# Altium schematic sheet Main.SchDoc: Oled Buttons
size A4; Author: Dániel Sinkó; Revision: A; SheetNumber: 1; SheetTotal: 1
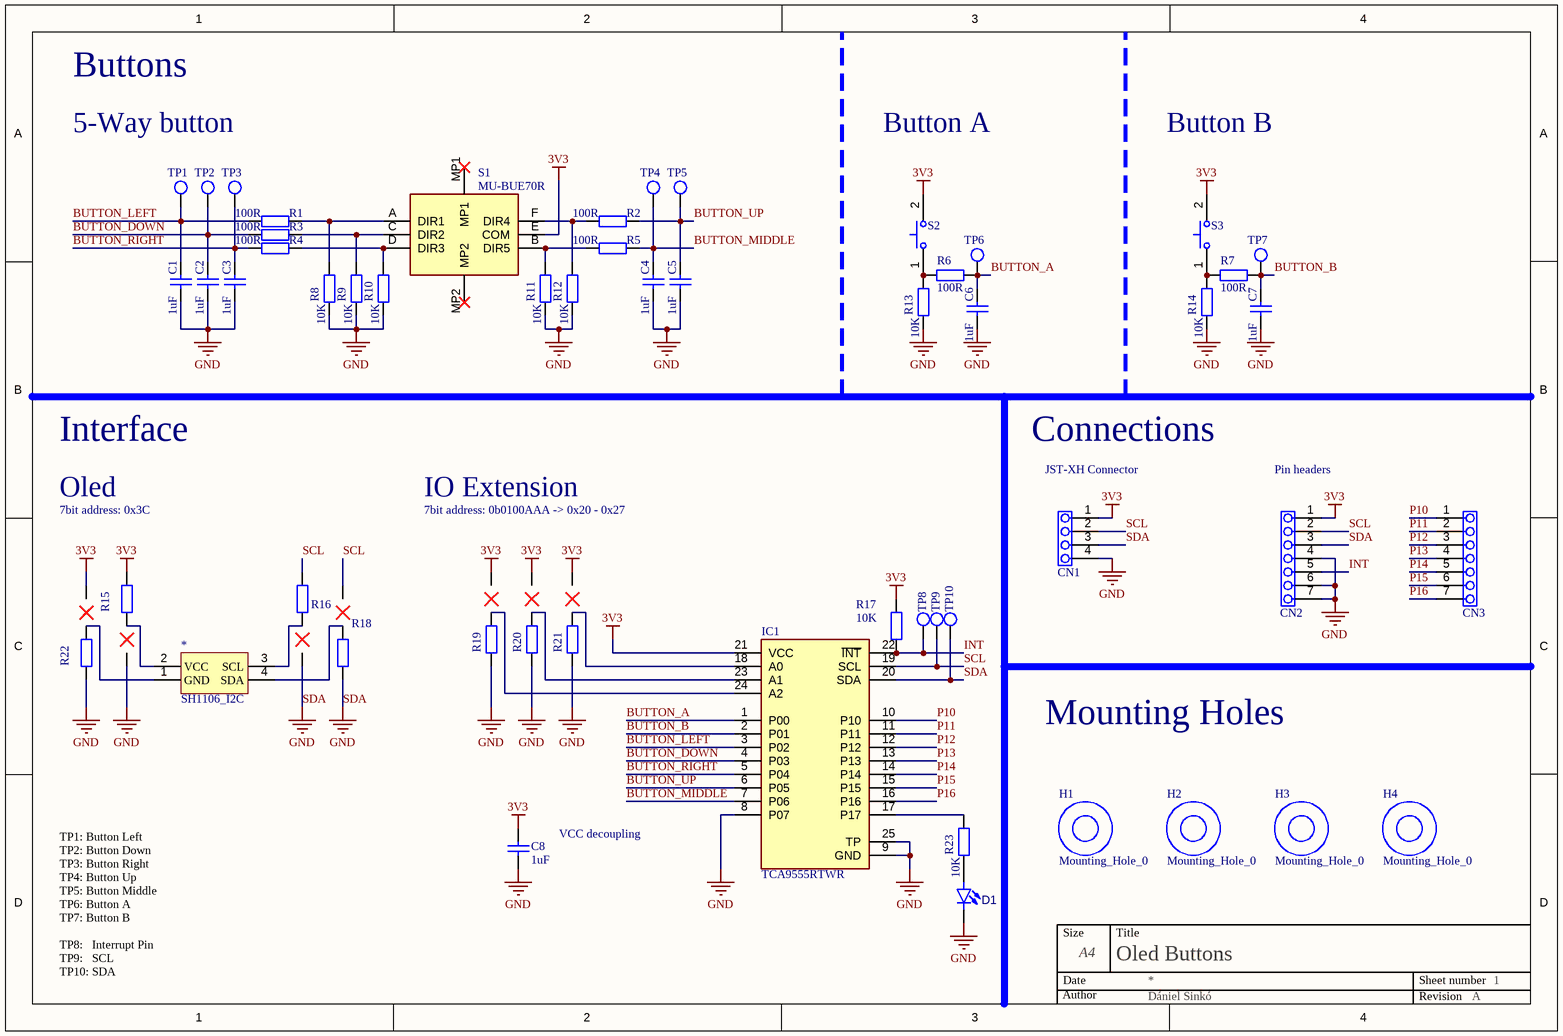
[diagram p0: Main.SchDoc]

## Parts
*  SH1106_I2C  [SH1106_I2C]
C1  1uF  [CAP0603]
C2  1uF  [CAP0603]
C3  1uF  [CAP0603]
C4  1uF  [CAP0603]
C5  1uF  [CAP0603]
C6  1uF  [CAP0603]
C7  1uF  [CAP0603]
C8  1uF  [CAP0603]
CN1  Pins 1x3  [PIN-1X4]  (value not drawn)
CN2  Pins 1x3  [PIN-1X7]  (value not drawn)
CN3  Pins 1x3  [PIN-1X7]  (value not drawn)
D1  (no value)  [LED0603]
H1  Mounting_Hole_0  [MOUNTING_HOLE_M3_0]
H2  Mounting_Hole_0  [MOUNTING_HOLE_M3_0]
H3  Mounting_Hole_0  [MOUNTING_HOLE_M3_0]
H4  Mounting_Hole_0  [MOUNTING_HOLE_M3_0]
IC1  TCA9555RTWR  [WQFN-24]
R1  100R  [RES0603]
R2  100R  [RES0603]
R3  100R  [RES0603]
R4  100R  [RES0603]
R5  100R  [RES0603]
R6  100R  [RES0603]
R7  100R  [RES0603]
R8  10K  [RES0603]
R9  10K  [RES0603]
R10  10K  [RES0603]
R11  10K  [RES0603]
R12  10K  [RES0603]
R13  10K  [RES0603]
R14  10K  [RES0603]
R15  *  [RES0603 _SELECTION]  (value not drawn)
R16  *  [RES0603 _SELECTION]  (value not drawn)
R17  10K  [RES0603]
R18  *  [RES0603 _SELECTION]  (value not drawn)
R19  *  [RES0603 _SELECTION]  (value not drawn)
R20  *  [RES0603 _SELECTION]  (value not drawn)
R21  *  [RES0603 _SELECTION]  (value not drawn)
R22  *  [RES0603 _SELECTION]  (value not drawn)
R23  10K  [RES0603]
S1  MU-BUE70R  [MUBUE70R]
S2  SKPMANE010  [SKPMAPE010]  (value not drawn)
S3  SKPMANE010  [SKPMAPE010]  (value not drawn)
TP1  Test Point  [TP_PAD]  (value not drawn)
TP2  Test Point  [TP_PAD]  (value not drawn)
TP3  Test Point  [TP_PAD]  (value not drawn)
TP4  Test Point  [TP_PAD]  (value not drawn)
TP5  Test Point  [TP_PAD]  (value not drawn)
TP6  Test Point  [TP_PAD]  (value not drawn)
TP7  Test Point  [TP_PAD]  (value not drawn)
TP8  Test Point  [TP_PAD]  (value not drawn)
TP9  Test Point  [TP_PAD]  (value not drawn)
TP10  Test Point  [TP_PAD]  (value not drawn)

## Nets
3V3: C8.2 CN1.1 CN2.1 IC1.21(VCC) R15.1 R17.2 R19.3 R20.3 R21.3 R22.3 S1.E(COM) S2.2 S3.2
SDA: C1.1 C2.1 C3.1 C4.1 C5.1 C6.1 C7.1 C8.1 CN1.3 CN1.4 CN2.3 CN2.4 CN2.6 CN2.7 D1.1(K) IC1.8(P07) IC1.9(GND) IC1.20(SDA) IC1.25(TP) R8.1 R9.1 R10.1 R11.1 R12.1 R13.1 R14.1 R15.3 R16.3 R18.1 R19.1 R20.1 R21.1 R22.1 TP10.1  [also labelled GND]
BUTTON_A: C6.2 IC1.1(P00) R6.1 TP6.1
BUTTON_B: C7.2 IC1.2(P01) R7.1 TP7.1
BUTTON_DOWN: C2.2 IC1.4(P03) R3.2 TP2.1
BUTTON_LEFT: C1.2 IC1.3(P02) R1.2 TP1.1
BUTTON_MIDDLE: C4.2 IC1.7(P06) R5.1 TP4.1
BUTTON_RIGHT: C3.2 IC1.5(P04) R4.2 TP3.1
BUTTON_UP: C5.2 IC1.6(P05) R2.1 TP5.1
INT: CN2.5 IC1.22(~{INT}) R17.1 TP8.1
P10: CN3.1 IC1.10(P10)
P11: CN3.2 IC1.11(P11)
P12: CN3.3 IC1.12(P12)
P13: CN3.4 IC1.13(P13)
P14: CN3.5 IC1.14(P14)
P15: CN3.6 IC1.15(P15)
P16: CN3.7 IC1.16(P16)
SCL: CN1.2 CN2.2 IC1.19(SCL) R16.1 R18.3 TP9.1
Net*_1: *.1(GND) R22.2
Net*_2: *.2(VCC) R15.2
Net*_3: *.3(SCL) R16.2
Net*_4: *.4(SDA) R18.2
NetD1_2: D1.2(A) R23.1
NetIC1_17: IC1.17(P17) R23.2
NetIC1_18: IC1.18(A0) R21.2
NetIC1_23: IC1.23(A1) R20.2
NetIC1_24: IC1.24(A2) R19.2
NetR1_1: R1.1 R8.2 S1.A(DIR1)
NetR2_2: R2.2 R12.2 S1.F(DIR4)
NetR3_1: R3.1 R9.2 S1.C(DIR2)
NetR4_1: R4.1 R10.2 S1.D(DIR3)
NetR5_2: R5.2 R11.2 S1.B(DIR5)
NetR6_2: R6.2 R13.2 S2.1
NetR7_2: R7.2 R14.2 S3.1

Not connected (* = marked no-connect by the designer): S1 MP1* MP2*

## Notes on the sheet
- Buttons
- 5-Way button
- Button A
- Button B
- Interface
- Connections
- Oled
- 7bit address: 0x3C
- 7bit address: 0b0100AAA -> 0x20 - 0x27
- IO Extension
- (near CN1) JST-XH Connector
- (near CN2) Pin headers
- Mounting Holes
- (near C8) VCC decoupling
- TP1: Button Left
  TP2: Button Down
  TP3: Button Right
  TP4: Button Up
  TP5: Button Middle
  TP6: Button A
  TP7: Button B
  TP8:   Interrupt Pin
  TP9:   SCL
  TP10: SDA
- Size
- Date
- A4
- Title
- Sheet number
- Author
- Revision

## Library data of the parts
C1-C8 = Capacitor: Voltage: *; Value: 1uF
CN1 = Pin-1x4: 2.54mm; Part Class: Connector; Order Code: 855-M50-3530342; CompType: M50-3530342; Distributor: Mouser; Package: SMD 1.27mm
CN2 CN3 = Pin-1x7: 2.54mm; Part Class: Connector; Order Code: 855-M50-3530342; CompType: M50-3530342; Distributor: Mouser; Package: SMD 1.27mm
D1 = LED: Light Emitting Diode
H1-H4 = Mounting_Hole_0: Mounting hole with no connectivity.
IC1 = TCA9555RTWR: Integrated Circuit; Manufacturer_Name: Texas Instruments; Datasheet Link: http://www.ti.com/lit/gpn/tca9555; Height: 0.8mm; Manufacturer_Part_Number: TCA9555RTWR; Mouser Part Number: 595-TCA9555RTWR; Mouser Price/Stock: https://www.mouser.co.uk/ProductDetail/Texas-Instruments/TCA9555RTWR?qs=O3wcJz4o8IcrHWYYvhjJoA%3D%3D; Arrow Part Number: TCA9555RTWR; Arrow Price/Stock: https://www.arrow.com/en/products/tca9555rtwr/texas-instruments?region=nac; LCSC Part Number: C42420609
R1-R14 R17 R23 = Resistor
  R1-R7: Value: 100R
  R8-R14 R17 R23: Value: 10K
R15 R16 R18-R22 = Resistor_Selection: Resistor; Value: *
S1 = MU-BUE70R: Switch; Manufacturer_Name: Apem; Datasheet Link: https://www.mouser.se/datasheet/2/26/PCB_MU_serie-3371204.pdf; Height: 7.2mm; Manufacturer_Part_Number: MU-BUE70R; LCSC Part Number: C2858287
S2 S3 = SKPMANE010: Switch (2-Pin Push); Manufacturer_Name: ALPS Electric; Datasheet Link: https://tech.alpsalpine.com/e/products/detail/SKPMANE010/; Height: 5mm; Manufacturer_Part_Number: SKPMANE010; Mouser Part Number: 688-SKPMAN; Mouser Price/Stock: https://www.mouser.co.uk/ProductDetail/Alps-Alpine/SKPMANE010?qs=m0BA540hBPdOXU%252BNv5vyYw%3D%3D